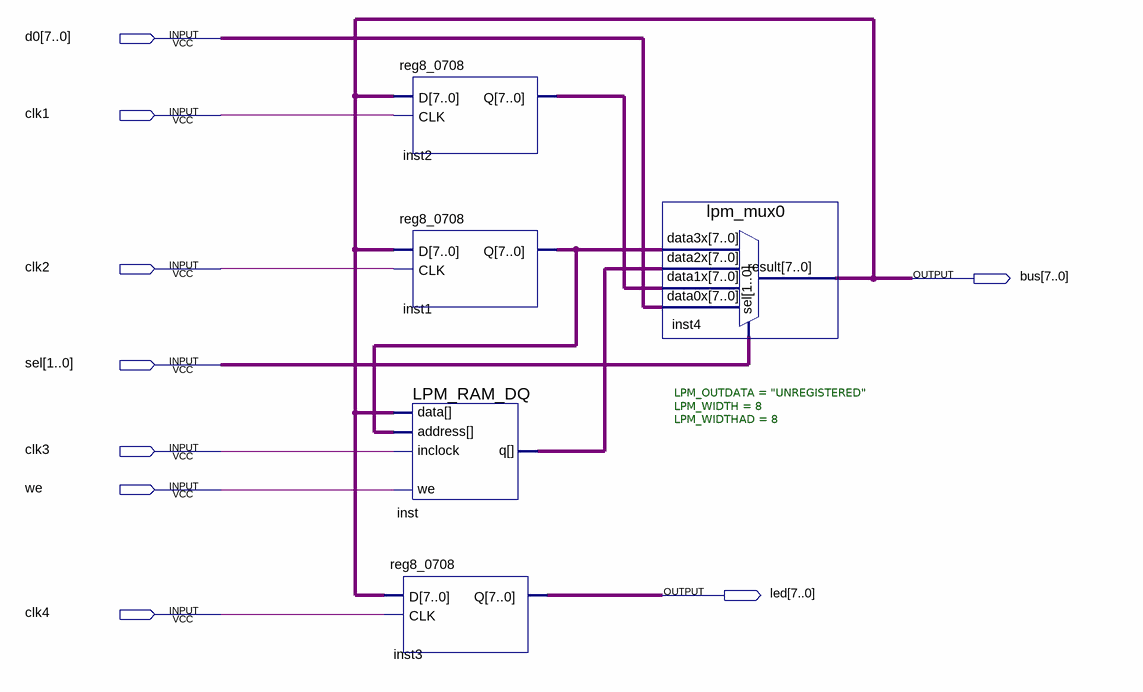
[diagram p0: schematic sheet]
// Quartus schematic BUS0708.bdf as structural Verilog: 5 symbols, 9 pins
module BUS0708 (
  input  [7:0] d0,
  input  clk1,
  input  clk2,
  input  [1:0] sel,
  input  clk3,
  input  we,
  input  clk4,
  output [7:0] bus,
  output [7:0] led
);

  wire [7:0] inst1_q, inst2_q, inst_q;

  reg8_0708 inst2 (.CLK(clk1), .D(bus), .Q(inst2_q));
  reg8_0708 inst1 (.CLK(clk2), .D(bus), .Q(inst1_q));
  LPM_RAM_DQ #(.LPM_OUTDATA("UNREGISTERED"), .LPM_WIDTH(8), .LPM_WIDTHAD(8)) inst (
    .address(inst1_q), .data(bus), .inclock(clk3), .we(we), .q(inst_q));
  reg8_0708 inst3 (.CLK(clk4), .D(bus), .Q(led));
  lpm_mux0 inst4 (.data3x(inst1_q), .data2x(inst_q), .data1x(inst2_q), .data0x(d0), .sel(sel), .result(bus));
endmodule
